# Altium schematic sheet FontesLineares.SchDoc
size A4; SheetNumber: 2; SheetTotal: 2
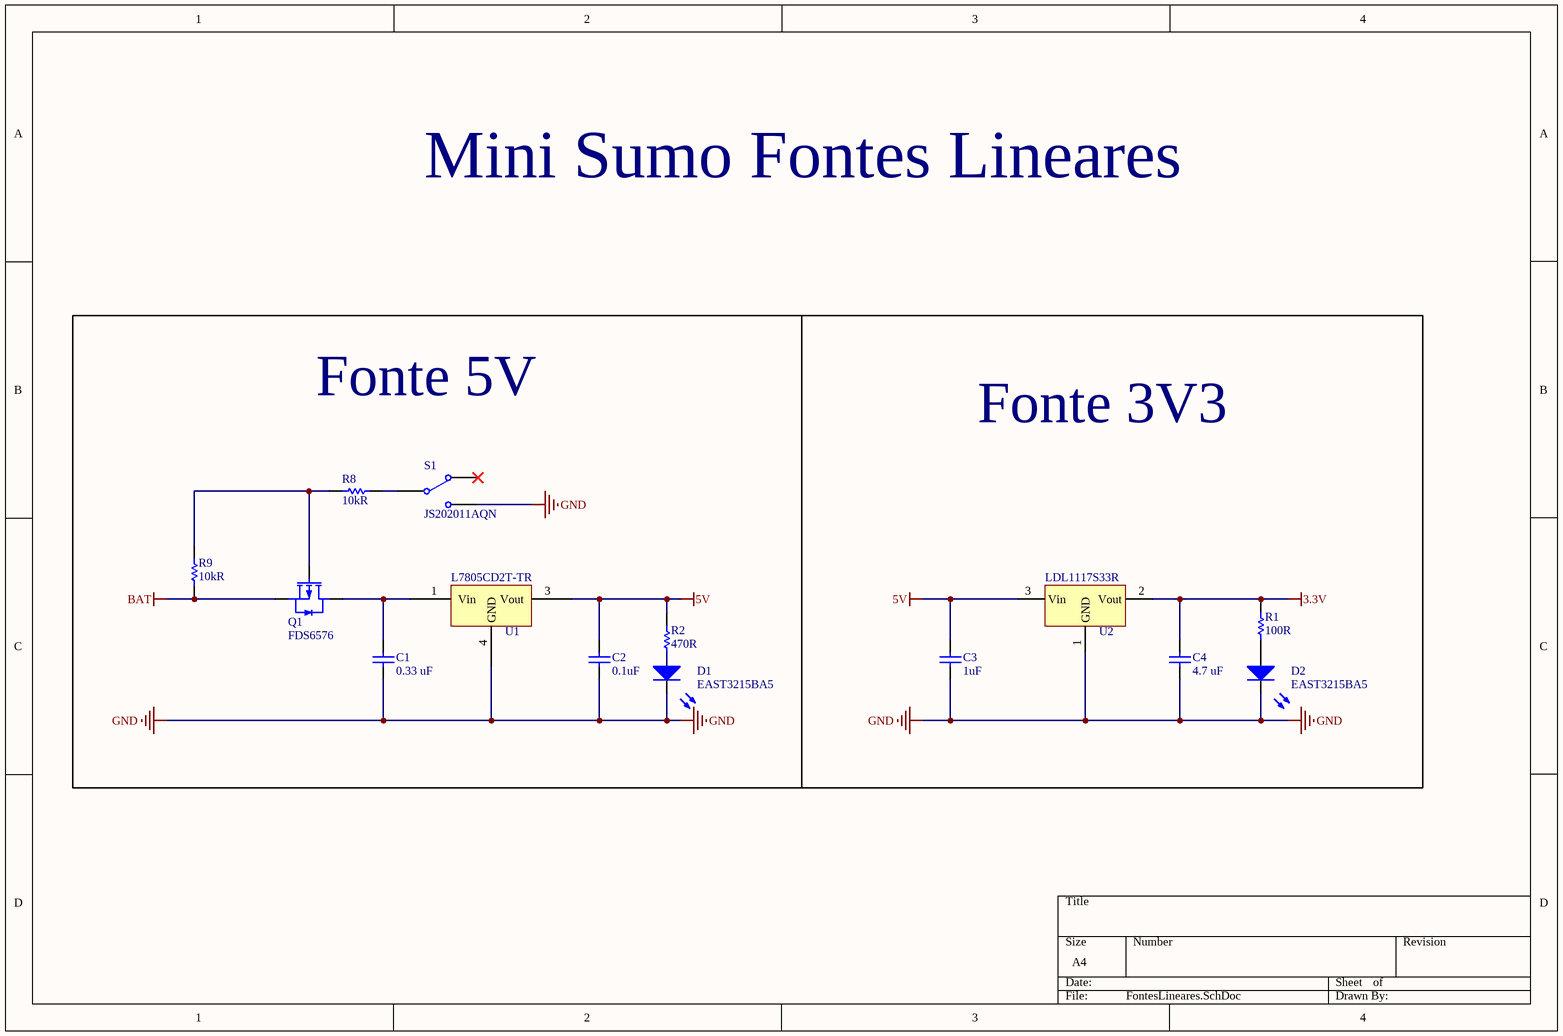
[diagram p0: FontesLineares.SchDoc]

## Parts
C1  0.33 uF  [C0805]
C2  0.1uF  [C0805]
C3  1uF  [C0603]
C4  4.7 uF  [C0805]
D1  EAST3215BA5  [DIODO_2-SMD-3215]
D2  EAST3215BA5  [DIODO_2-SMD-3215]
Q1  FDS6576  [SOIC-8]
R1  value 100R  [RESISTOR_0805]  (hidden comment: CRCW0805100RFKEA)
R2  value 470R  [RESISTOR_0805]  (hidden comment: ERJ-6GEYJ471V)
R8  10kR  [RESISTOR_0603]
R9  10kR  [RESISTOR_0603]
S1  JS202011AQN  [SOIC6_THRU_HOLE]
U1  L7805CD2T-TR  [D2PAK_V2]
U2  LDL1117S33R  [SOT-223-4]

## Nets
3.3V: C4.2 R1.2 U2.2(Vout)
5V: C2.2 C3.2 R2.2 U1.3(Vout) U2.3(Vin)
BAT: Q1.S R9.1
GND: C1.1 C2.1 C3.1 C4.1 D1.C D2.C S1.2(NO) U1.4(GND) U2.1(GND)
NetC1_2: C1.2 Q1.D U1.1(Vin)
NetD1_A: D1.A R2.1
NetD2_A: D2.A R1.1
NetQ1_G: Q1.G R8.2 R9.2
NetR8_1: R8.1 S1.C(COMMON)

Not connected (* = marked no-connect by the designer): S1 1*

## Notes on the sheet
- Mini Sumo Fontes Lineares
- Fonte 5V
- Fonte 3V3

## Library data of the parts
C1 = GCM21BR71E334KA37K: CAP CER 0.33UF 25V X7R 0805; Manufacturer: Murata Eletronics; Tolerance: 10%; Voltage - Rated: 25 VDC; Library Control - Checked Footprint: Yes; Library Control - Person that Checked Footprint: Nikaum; Supplier 1: Mouser; Part Number: GCM21BR71E334KA37K; Category: Ceramic Capacitor; Price: 1= 0,57, 10= 0,398, 100= 0,239 (USD); Supplier Part Number 1: 81-GCM21BR71E334KA7K; Library Ref: Capacitor; Operating Temperature: -55 C ~ 125 C; Package / Case: 0805 (2012 Metric); Size / Dimension: 2,00 L x 1,25 W x 1,25 H; Value: 0.33 uF; Dieletric: X7R; Library Control - Checked Schematic: Yes; Library Control - Last Update: 28/06/2021 00:57; Library Control - Person that Checked Schematic: Nikaum; Library Control - Person that did the Last Update Footprint: Nikaum; Library Control - Person that did the Last Update Schematic: Nikaum; ComponentLink1Description: Datasheet; ComponentLink1URL: https://br.mouser.com/datasheet/2/281/GCM21BR71E334KA37_01-1968656.pdf; ComponentLink2Description: Mouser Link; ComponentLink2URL: https://br.mouser.com/ProductDetail/Murata-Electronics/GCM21BR71E334KA37K?qs=N3Kl9KD794Tg%2FXM5q2uFQQ%3D%3D; ComponentLink3Description: ESR; ComponentLink3URL: https://www.murata.com/en-us/products/productdetail?partno=GCM21BR71E334KA37%23
C2 = C0805C104M3RACTU: CAP CER 0.1uF 25V X7R 0805; Manufacturer: Kemet; Tolerance: 20%; Voltage - Rated: 25 VDC; Library Control - Checked Footprint: No; Library Control - Checked Schematic: Yes; Library Control - Person that Checked Schematic: Guilherme; Library Control - Person that did the Last Update Schematic: Marcos; Supplier 1: Mouser; Part Number: C0805C104M3RACTU; Category: Ceramic Capacitor; Price: 1=0,13 10=0,064 100=0,037 1000=0,025 (USD); Supplier Part Number 1: 80-C0805C104M3R; Library Ref: Capacitor; Operating Temperature: -55 C ~ 125 C; Package / Case: 0805(2012 mestric); Size / Dimension: 1.25 mm W x 2 mm L x 0.78 mm H; Value: 0.1uF; ESR: -; Dieletric: X7R; Library Control - Last Update: 26/06/2021 20:52; ComponentLink1Description: Datasheet; ComponentLink1URL: https://br.mouser.com/datasheet/2/212/KEM_C1002_X7R_SMD-1102033.pdf; ComponentLink2Description: Mouser Link; ComponentLink2URL: https://br.mouser.com/ProductDetail/KEMET/C0805C104M3RACTU?qs=jbCUrP3sAgSIdMuvv9W4Pg%3D%3D
C3 = Capacitor Model: CAP CER 1UF 25V X7R 0603; Value: 1uF; ComponentLink1Description: Mouser Link; ComponentLink1URL: *; ComponentLink2Description: Datasheet; ComponentLink2URL: *
C4 = GRM219R61E475KA73D: CAP CER 4.7uF 25V X5R 0805; Manufacturer: MURATA ELECTRONICS; Tolerance: 10%; Voltage - Rated: 25 VDC; Library Control - Checked Footprint: Yes; Library Control - Person that Checked Footprint: Cage; Supplier 1: Mouser; Part Number: GRM219R61E475KA73D; Category: Ceramic Capacitors; Price: 1=0,28 10=0,193 100=0,098 1000=0,059 (USD); Supplier Part Number 1: 81-GRM219R61E475KA73D; Library Ref: Capacitor; Operating Temperature: -55°C ~ 85°C; Package / Case: 0805(2012 metric); Size / Dimension: 2 mm L x 1.25 mm W x 0.85 mm H; ESR: -; Dieletric: X5R; Library Control - Checked Schematic: Yes; Library Control - Last Update: 25/08/22; Library Control - Person that Checked Schematic: Cage; Library Control - Person that did the Last Update Footprint: Cage; Library Control - Person that did the Last Update Schematic: Cage; ComponentLink1Description: Datasheet; ComponentLink1URL: https://br.mouser.com/datasheet/2/281/1/GRM219R61E475KA73_01A-1986363.pdf; ComponentLink2Description: Mouser Link; ComponentLink2URL: https://br.mouser.com/ProductDetail/Murata-Electronics/GRM219R61E475KA73D?qs=%2Fha2pyFadui1540apPxqrcvNL2Od6%2FE9q78FE8iyERiL9ZO4NhnlONCgyc%2FC2rEQ; Value: 4.7 uF
D1 D2 = CMP-010-000005-1: LED 75mW BLUE 45MCD 3215; Manufacturer: Everlight Electronics; Library Control - Person that did the Last Update Footprint: Stéfany (Ster); Wavelength: 468 nm; Viewing Angle: 130°; Reverse Voltage: 5 V; Library Control - Checked Footprint: yes; Current - Forward (If): 20 mA; Voltage - Forward (Vf): 3,30 V; Library Control - Person that Checked Schematic: Lucas; Operating Temperature: - 40 °C ~ 85 °C; Source: Diodo.SchLib; Library Control - Last Update: 13/06/2021 12:45; Pin Count: 2; ComponentLink1URL: https://www.mouser.com/ProductDetail/Everlight/EAST3215BA5?qs=Cqqh%252BS766wnzp9nQVj5A4g==; Part Number: EAST3215BA5; Component Type: Standard; Max Power Dissipation: 75 mW; Library Control - Person that did the Last Update Schematic: Stéfany (Ster); Luminous Intensity: 45 mcd; Design Item ID: EAST3215BA5; Price: 1 = 0,3800, 10 = 0,2050, 100 = 0.1080 (USD); Package / Case: 3215; Library Control - Checked Schematic: yes; Color: Blue; ComponentLink2URL: https://www.mouser.com/datasheet/2/143/EAST3215BA5-1154292.pdf; ComponentLink2Description: Datasheet; Library Control - Person that Checked Footprint: Lucas; Category: Standard LEDs - SMD; ComponentLink1Description: Mouser Link; Max Current Rating: 20 mA
Q1 = FDS6576: MOSFET P-CH 20V 11A SOIC-8; Manufacturer: onsemi / Fairchild; FET Type: P-Channel; Rds On (Max) @ Id, Vgs: 23mOhms @ -11A, -4.5V; Input Capacitance (Ciss) (Max) @Vds: 4044pF@-10V; Drain to Source Voltage (Vds): -20V; Vgs(th) (Max) Id: -1.5V@-250uA; Current - Continuous Drain (Id) @25°C: -11A; Gate Charge (Qg) (Max) @ Vgs: 60nC@-4.5V; Power Dissipation (Max): 2.5W; Drive Voltage (Max Rds On, Min Rds On): -2.5V ~4.5V; Vgs (Max): 12V; Rise / Fall Time (Typ): 17 / 79 (ns); Part Number: SOIC-8; Price: 1=1.34, 10=1.20, 100=0.932, 500=0.77, 1000=0.608 (USD); Package / Case: SOIC-8; Operating Temperature: -55 °C ~150 °C; Supplier 1: Mouser; Library Ref: Mosfet; Supplier Part Number 1: 512-FDS6576; ComponentLink1Description: Datasheet; ComponentLink1URL: https://br.mouser.com/datasheet/2/308/1/FDS6576_D-1808687.pdf; ComponentLink2Description: Mouser; ComponentLink2URL: https://br.mouser.com/ProductDetail/onsemi-Fairchild/FDS6576?qs=FOlmdCx%252BAA1N14vq5QZP7Q%3D%3D
R1 = CMP-013-000028-1: RES SMD 100 OHM 1% 1/8W 0805; Manufacturer: Vishay / Dale; Library Control - Person that did the Last Update Footprint: Dalarme; Power Rating: 125 mW (1/8 W); Temperature Coefficient: 100 PPM / C; Voltage Rating: 150 V; Library Control - Checked Footprint: No; Library Control - Person that did the Last Update Schematic: Marcos; Library Control - Checked Schematic: Yes; Library Control - Last Update: 20/06/21 16:56; Part Number: CRCW0805100RFKEA; Resistor Type: Fixo; ComponentLink1Description: Mouser Link; ComponentLink2Description: Datasheet Link; Category: Thick Film Resistors - SMD; Size / Dimension: 2 mm L x  1.25 mm W x  0.45 mm H; Component Type: Standard; Source: Resistor.SchLib; Price: 1=0,18, 10=0,065, 100=0,027, 1000=0,012 (USD); Package / Case: 0805 (2012 Metric); Design Item ID: CRCW0805100RFKEA; Operating Temperature: - 55ºC ~ 155ºC; Library Control - Person that Checked Schematic: Marcos; Tolerance: 1 %; Pin Count: 2; ComponentLink2URL: https://www.mouser.com/datasheet/2/427/dcrcwe3-1762152.pdf; ComponentLink1URL: https://www.mouser.com/ProductDetail/Vishay-Dale/CRCW0805100RFKEA?qs=sGAEpiMZZMu61qfTUdNhG2DpbjADlD3GxPcNG3UnvYk%3D
R2 = CMP-013-000050-1: RES SMD 470 OHM 5% 1/8W 0805; Part Number: 667-ERJ-6GEYJ471V; Manufacturer: Panasonic; Library Control - Checked Footprint: No; Library Control - Checked Schematic: Yes; Library Control - Person that Checked Schematic: Marcos; Voltage Rating: 150 V; Temperature Coefficient: 200 PPM / C; Power Rating: 125 mW (1/8 W); Library Control - Person that did the Last Update Footprint: Dalarme; ComponentLink1URL: https://br.mouser.com/datasheet/2/315/AOA0000C301-1488782.pdf; Resistor Type: Fixo; Category: Thick Film Resistors - SMD; Source: Resistor.SchLib; Operating Temperature: - 55ºC ~ 155ºC; ComponentLink1Description: Datasheet Link; ComponentLink2URL: https://www.mouser.com/ProductDetail/Panasonic/ERJ-6GEYJ471V?qs=%2Fha2pyFadujWqMGonbcVXQOcxwQBA8OuqUzw3XmrY6vv5LW7wYDrug%3D%3D; Library Control - Person that did the Last Update Schematic: Marcos; Price: 1=0,1000, 10=0,04300, 100=0,02000 1000 = 0,009(USD); Tolerance: 5 %; ComponentLink2Description: Mouser Link; Package / Case: 0805 (2012 Metric); Pin Count: 2; Design Item ID: ERJ-6GEYJ471V; Library Control - Last Update: 20/06/21 16:06; Component Type: Standard; Size / Dimension: 2 mm L x  1.25 mm W x  0.6 mm H
R8 R9 = RC0603JR-0710KL: RES SMD 10K OHM 5% 1/10W 0603; Manufacturer: Yageo; Temperature Coefficient: 100 PPM / C; Power Rating: 100 mW (1/10 W); Voltage Rating: 75 V; Library Control - Checked Footprint: No; Library Control - Checked Schematic: Yes; Library Control - Person that Checked Schematic: Marcos; Library Control - Person that did the Last Update Footprint: Dalarme; Supplier 1: Mouser; Part Number: RC0603JR-0710KL; Category: Thick Film Resistors - SMD; Price: 1=0,10, 10=0,015, 100=0,005 1000=0,0040 (USD); Package / Case: 0603 (1608 Metric); Operating Temperature: - 55ºC ~ 155ºC; Value: 10kR; Tolerance: 5 %; Library Ref: Resistor; Resistor Type: Fixo; Size / Dimension: 1.6 mm L x  0.8 mm W x  0.45 mm H; Supplier Part Number 1: 603-RC0603JR-0710KL; Library Control - Last Update: 21/06/21 14:15; Library Control - Person that did the Last Update Schematic: Marcos; ComponentLink1Description: Mouser Link; ComponentLink1URL: https://br.mouser.com/ProductDetail/Yageo/RC0603JR-0710KL?qs=ksOUTF%2FWcd8D6T22BJkQ7g%3D%3D; ComponentLink2Description: Datsheet Link; ComponentLink2URL: https://br.mouser.com/datasheet/2/447/Yageo_03_18_2021_PYu_RC_Group_51_RoHS_L_11-2199992.pdf
S1 = JS202011CQN_1: SLIDE SWITCH DPDT 0.3A 30VDC THRU ROLE; Manufacturer: C&K Switches; Voltage Rating (DC): 6VDC; Current Rating: 300mA; Switch Function: On-On; Library Control - Checked Footprint: Yes; Library Control - Last Project that Used: Follow-Final; Library Control - Person that did the Last Update Footprint: Lucas; Supplier 1: Mouser; Part Number: JS202011AQN; Category: Slide Switches; Pricing 1: 1=0,450, 25=0,421, 100=0,357 (USD); Throw Configuration: DPDT; Orientation: Horizontal; Supplier Part Number 1: 611-JS202011AQN; Library Ref: Slide Switches; Library Control - Checked Schematic: Yes; Library Control - Last Update: 30/10/2021 23:13; Library Control - Person that did the Last Update Schematic: Lucas; ComponentLink1Description: Datasheet; ComponentLink1URL: https://br.mouser.com/datasheet/2/60/js-1841892.pdf; ComponentLink2Description: Mouser Link; ComponentLink2URL: https://br.mouser.com/ProductDetail/CK/JS202011CQN?qs=%2Fha2pyFadujEk0HYYCwwdCngFEJLgpLwbgeFG0CLXqejQrlcBWDxEg%3D%3D
U1 = L7805CD2T-TR: IC REG LINEAR 5V 1A D2PAK; Manufacturer: ST; Max Power Dissipation: Internally Limited; Output Type: Fixed; Number of Regulators: 1; Voltage - Input (Max): 35V; Current - Quiescent (Iq): 8mA; Voltage - Dropout (Max): 2V; Library Control - Checked Footprint: Yes; Library Control - Person that Checked Footprint: Nícolas; Voltage - Output (Max): 5.25V; Supplier 1: Mouser; Part Number: L7805CD2T-TR; Library Ref: Voltage Regulator; Category: Linear Voltage Regulator; Price: 1=0,93, 10=0,83, 100=0,79 (USD); Datasheet: https://br.mouser.com/datasheet/2/389/cd00000444-1795274.pdf; Package/ Case: D2PAK; Operating Temperature: -40~125 ºC; Mouser Link: https://br.mouser.com/ProductDetail/STMicroelectronics/L7805CD2T-TR?qs=%2Fha2pyFadujE9KQ1BxQHaLKqcK8XYkwQA8UfL%2FIGb8dfQq%2Fq%2FT%2Fjqg%3D%3D; Voltage - Output (Min/Fixed): 5V; Supplier Part Number 1: 511-L7805CD2T-TR; Library Control - Checked Schematic: Yes; Library Control - Last Update: 25/06/21; Library Control - Person that Checked Schematic: Nícolas; Library Control - Person that did the Last Update Schematic: Nícolas; Current - Output: 1A; Power Dissipation: Internally Limited
U2 = LDL1117S33R: IC REG LINEAR 3.3V 1.2A SOT-223-4; Manufacturer: STMicroelectronics; Max Power Dissipation: Internally limited; Output Type: Fixed; Number of Regulators: 1; Voltage - Input (Max): 18V; Current - Quiescent (Iq): 250 uA; Voltage - Dropout (Max): 600mV (1.2 A); Library Control - Checked Footprint: Yes; Library Control - Person that Checked Footprint: Nícolas; Library Control - Person that did the Last Update Footprint: Pierre; Voltage - Output (Max): 3.6V; Supplier 1: Mouser; Part Number: LDL1117S33R; Library Ref: Voltage Regulator; Category: Linear Voltage Regulator; Price: 1= 0.46000, 10= 0.34000, 100= 0.22900 (USD); Package/ Case: SOT-223-4; Operating Temperature: -40°C~125°C; Voltage - Output (Min/Fixed): 3.3 V; Supplier Part Number 1: 511-LDL1117S33R; Library Control - Checked Schematic: Yes; Library Control - Last Update: 23/06/21 10:22; Library Control - Person that Checked Schematic: Nícolas; Library Control - Person that did the Last Update Schematic: Nícolas; Current - Output: 1.2 A; Power Dissipation: Internally limited; ComponentLink1Description: Mouser Link; ComponentLink1URL: https://br.mouser.com/ProductDetail/STMicroelectronics/LDL1117S33R?qs=%2Fha2pyFadugA91l4ky%2FRZ5SN3GrMJ6YI2MUHTqmRDLfkBVrFdA%252BW6Q%3D%3D; ComponentLink2Description: Datasheet; ComponentLink2URL: https://br.mouser.com/datasheet/2/389/dm00366442-1799212.pdf